# EAGLE design VGA-Slot14 (EAGLE 6.6.0)
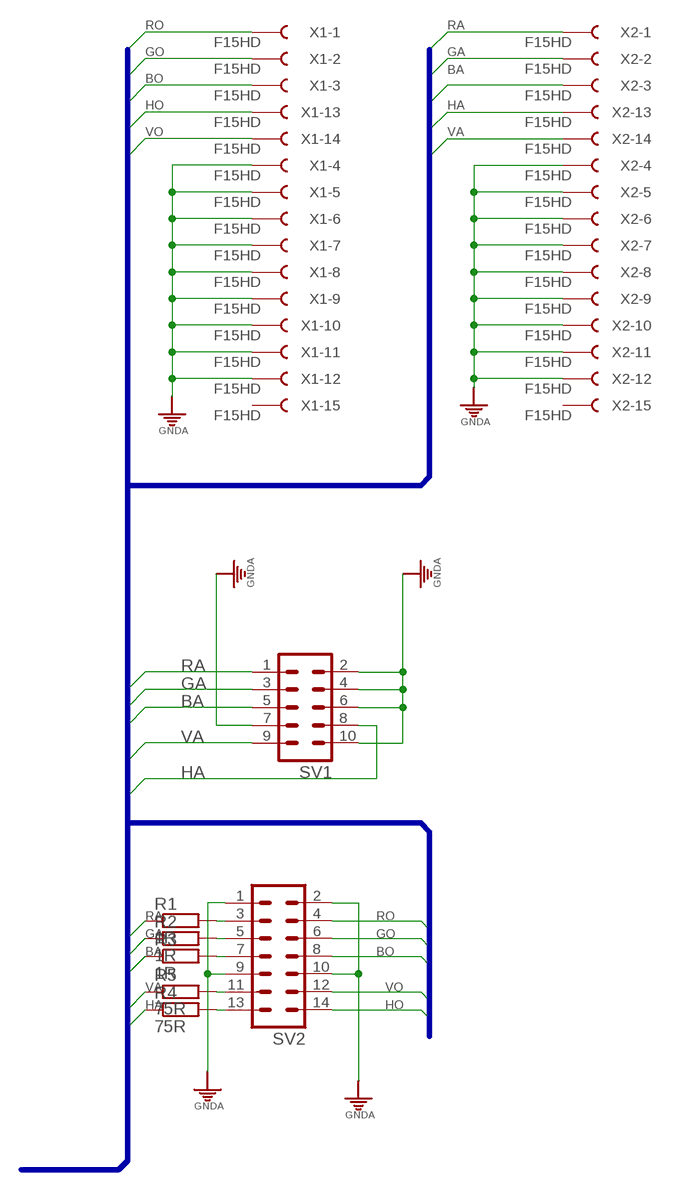
[diagram p0: schematic, sheet 1]

## Parts
R1  1R  R-EU_R0805  [R0805]
R2  1R  R-EU_R0805  [R0805]
R3  1R  R-EU_R0805  [R0805]
R4  75R  R-EU_R0805  [R0805]
R5  75R  R-EU_R0805  [R0805]
SV1  ML10  [ML10]
SV2  ML14  [ML14]
X1  F15HD  [F15HD]
X2  F15HD  [F15HD]

## Nets
BA: R3.1 SV1.5 X2.3
BO: SV2.8 X1.3
GA: R2.1 SV1.3 X2.2
GNDA: SV1.2 SV1.4 SV1.6 SV1.7 SV1.10 SV2.1 SV2.2 SV2.9 SV2.10 X1.4 X1.5 X1.6 X1.7 X1.8 X1.9 X1.10 X1.11 X1.12 X2.4 X2.5 X2.6 X2.7 X2.8 X2.9 X2.10 X2.11 X2.12
GO: SV2.6 X1.2
HA: R4.1 SV1.8 X2.13
HO: SV2.14 X1.13
N$1: R2.2 SV2.5
N$2: R1.2 SV2.3
N$3: R3.2 SV2.7
N$4: R5.2 SV2.11
N$5: R4.2 SV2.13
RA: R1.1 SV1.1 X2.1
RO: SV2.4 X1.1
VA: R5.1 SV1.9 X2.14
VO: SV2.12 X1.14
Unconnected: X1.15 X2.15

## Buses
RA,GA,BA,VA,HA,RO,GO,BO,VO,HO

## Library data of the parts
R1-R5 = rcl:R-EU_: RESISTOR, European symbol
SV1 = con-harting-ml:ML10: HARTING; OC_FARNELL: unknown; OC_NEWARK: unknown
SV2 = con-harting-ml:ML14: HARTING; OC_FARNELL: unknown; OC_NEWARK: unknown
X1 X2 = SUBD-A:F15HD

## Board
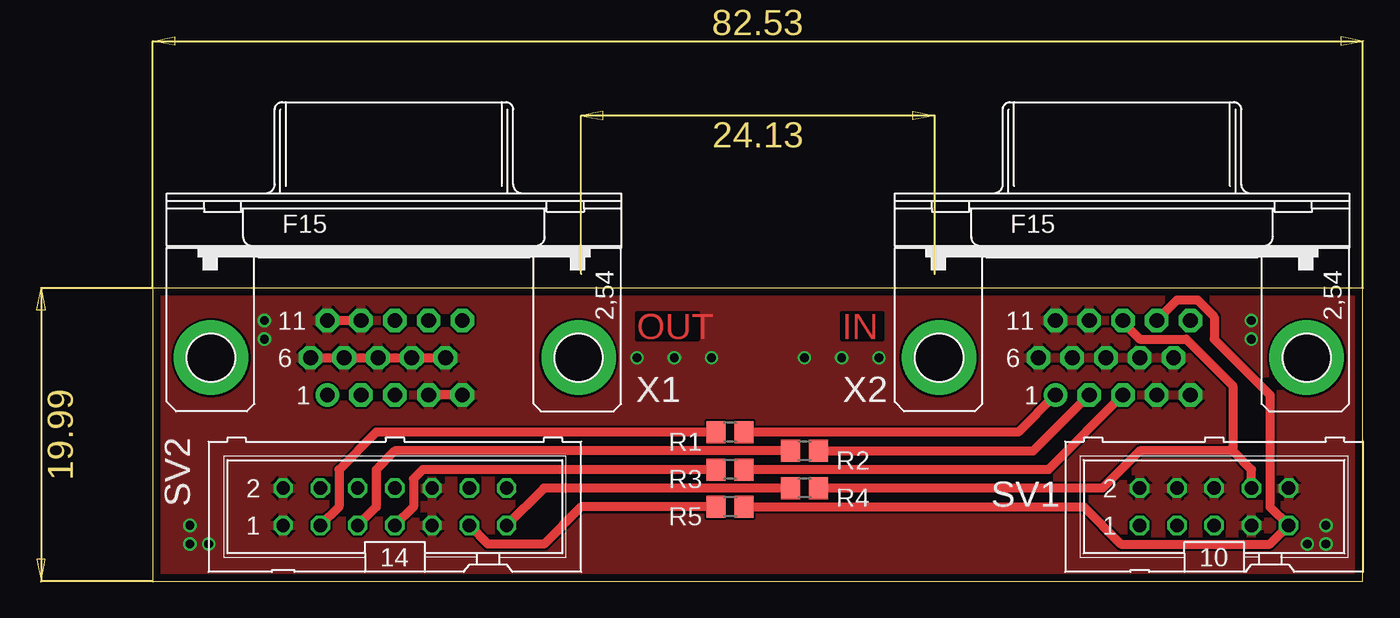
[diagram p1: board, top side]
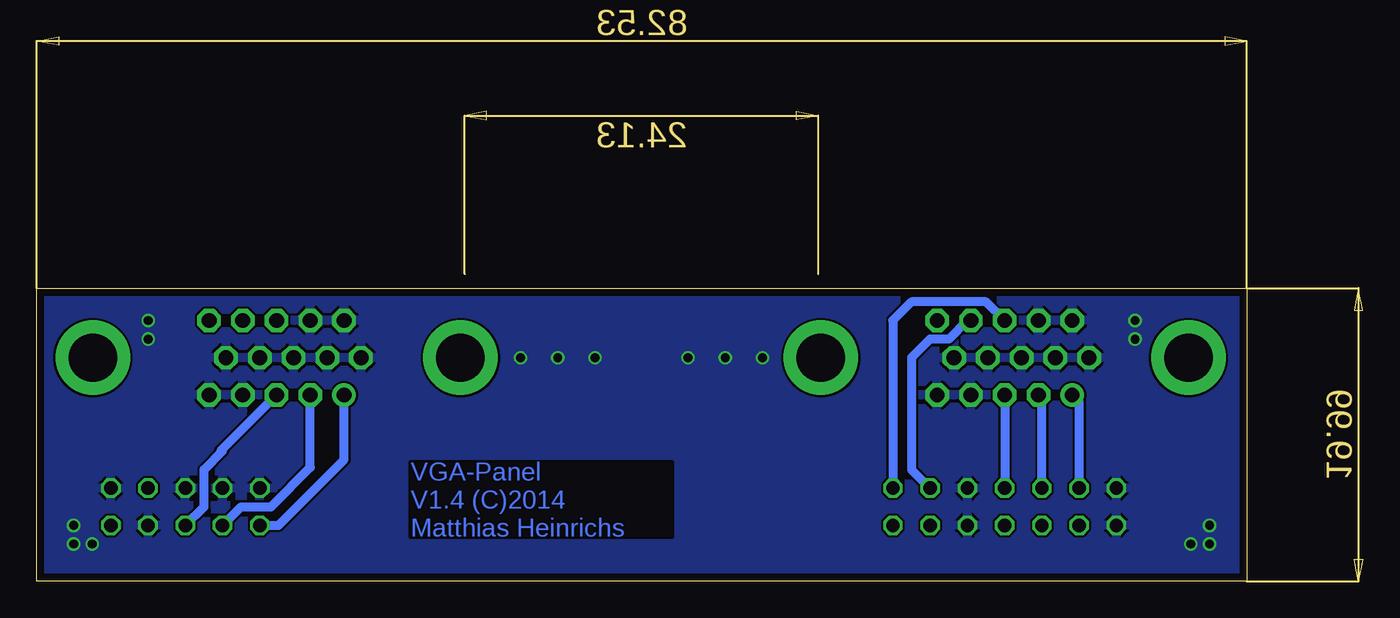
[diagram p2: board, bottom side, seen from below]

Size 82.53 x 19.99 mm. Coordinates in mm from the lower left corner, seen from the top.
Outline: 0,0 82.53,0 82.53,19.99 0,19.99 0,0
Copper layers (1*16): Top 0.035mm / dielectric 1.5mm / Bottom 0.035mm
Design rules "leiton": minimum track width 6mil, minimum drill 0.3mm, track to track 6mil, track to pad 6mil, pad to pad 6mil, via to via 6mil, smd to smd 6mil, copper to edge 20mil, drill to drill 8mil, minimum pad ring 8mil, minimum via ring 6mil, stop-mask expansion 3mil, vias tented up to drill 0mil, thermal gap 8mil

### Footprints (pad centres in the part's own frame; a part is rotated, then mirrored left to right if it is on the bottom)
R0805 = smd 1.3 x 1.5: 1 -0.95,0; 2 0.95,0
ML10 = drill 0.914 octagon: 1 -5.08,-1.27; 2 -5.08,1.27; 3 -2.54,-1.27; 4 -2.54,1.27; 5 0,-1.27; 6 0,1.27; 7 2.54,-1.27; 8 2.54,1.27; 9 5.08,-1.27; 10 5.08,1.27
ML14 = drill 0.914 octagon: 1 -7.62,-1.27; 2 -7.62,1.27; 3 -5.08,-1.27; 4 -5.08,1.27; 5 -2.54,-1.27; 6 -2.54,1.27; 7 0,-1.27; 8 0,1.27; 9 2.54,-1.27; 10 2.54,1.27; 11 5.08,-1.27; 12 5.08,1.27; 13 7.62,-1.27; 14 7.62,1.27
F15HD = drill 1.016 pad 1.6: 1 -4.604,-2.54 | drill 1.016 pad 1.6 octagon: 2 -2.302,-2.54; 3 0,-2.54; 4 2.302,-2.54; 5 4.604,-2.54; 6 -5.755,0; 7 -3.453,0; 8 -1.151,0; 9 1.151,0; 10 3.453,0; 11 -4.604,2.54; 12 -2.302,2.54; 13 0,2.54; 14 2.302,2.54; 15 4.604,2.54 | drill 3.302 pad 5.08: G1 -12.535,0; G2 12.535,0

### Placement (x,y rotation side)
R1  39.37,10.16 180 top
R2  44.45,8.89 180 top
R3  39.37,7.62 180 top
R4  44.45,6.35 180 top
R5  39.37,5.08 180 top
SV1  72.39,5.08 0 top
SV2  16.51,5.08 0 top
X1  16.51,15.24 0 top
X2  66.17,15.24 0 top

### Tracks (layer width: path | path; a pad name or v marks a point on that pad's centre or on a via)
BA
  Top 0.61: X2.3 61.09,7.62 R3.1
  Bottom 0.61: SV1.5 71.12,5.08 71.12,7.62 69.85,8.89 69.98,8.89 X2.3
BO
  Bottom 0.61: X1.3 SV2.8
GA
  Top 0.61: X2.2 60.05,8.89 R2.1
  Bottom 0.61: SV1.3 68.58,5.08 66.55,5.08 63.87,7.76 X2.2
GNDA  (via drill 0.6)
  Top 0.61: X1.6 X1.7 X1.8 X1.9 X1.10 | X1.5 X1.4 | X1.11 X1.12
  other vias: 7.62,17.78 7.62,16.51 2.54,3.81 2.54,2.54 3.81,2.54 33.02,15.24 35.56,15.24 49.53,15.24 46.99,15.24 44.45,15.24 38.1,15.24 74.93,17.78 74.93,16.51 80.01,3.81 80.01,2.54 78.74,2.54
  pour Top: 0.38,25.91 82.17,25.91 82.17,0.38 0.38,0.38
  pour Bottom: 0.38,25.91 82.17,25.91 82.17,0.38 0.38,0.38
GO
  Bottom 0.61: SV2.6 13.97,12.46 X1.2
HA
  Top 0.61: SV1.8 74.93,7.62 73.66,8.89 | 73.66,8.89 67.31,8.89 64.77,6.35 R4.1 | X2.13 66.17,17.65 67.31,16.51 70.48,16.51 73.66,13.34 73.66,8.89
HO
  Bottom 0.61: X1.13 | X1.13 17.78,19.05 22.86,19.05 24.13,17.78 SV2.14
N$1
  Top 0.61: R2.2 16.51,8.89 15.24,7.62 15.24,5.08 SV2.5
N$2
  Top 0.61: R1.2 15.24,10.16 12.7,7.62 12.7,5.08 SV2.3
N$3
  Top 0.61: R3.2 18.41,7.62 17.78,6.99 17.78,5.08 SV2.7
N$4
  Top 0.61: R5.2 29.21,5.08 26.67,2.54 22.86,2.54 SV2.11
N$5
  Top 0.61: R4.2 26.67,6.35 SV2.13
RA
  Top 0.61: X2.1 59.02,10.16 R1.1
  Bottom 0.61: SV1.1 66.04,3.81 61.56,8.29 X2.1
RO
  Bottom 0.61: SV2.4 11.43,12.22 X1.1
VA
  Top 0.61: X2.14 69.87,19.18 71.25,19.18 72.39,18.03 72.39,16.51 76.2,12.7 76.2,5.08 SV1.9 76.2,2.54 66.04,2.54 63.5,5.08 R5.1
VO
  Bottom 0.61: X1.14 19.05,17.78 20.32,16.51 21.59,16.51 22.86,15.24 22.86,7.62 SV2.12

### Text on the board
Top: OUT | IN
Bottom: VGA-Panel / V1.4 (C)2014 / Matthias Heinrichs